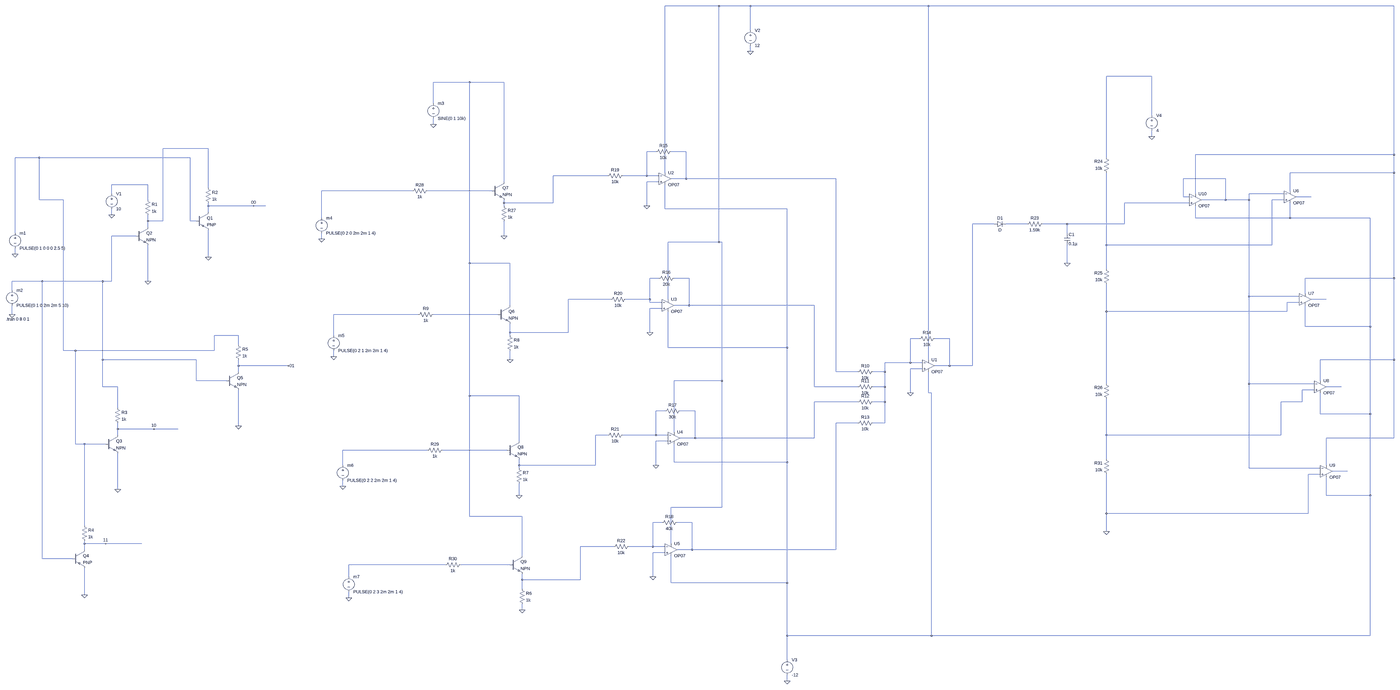
[diagram p0: schematic 4ary ask_final_2.asc, whole sheet]
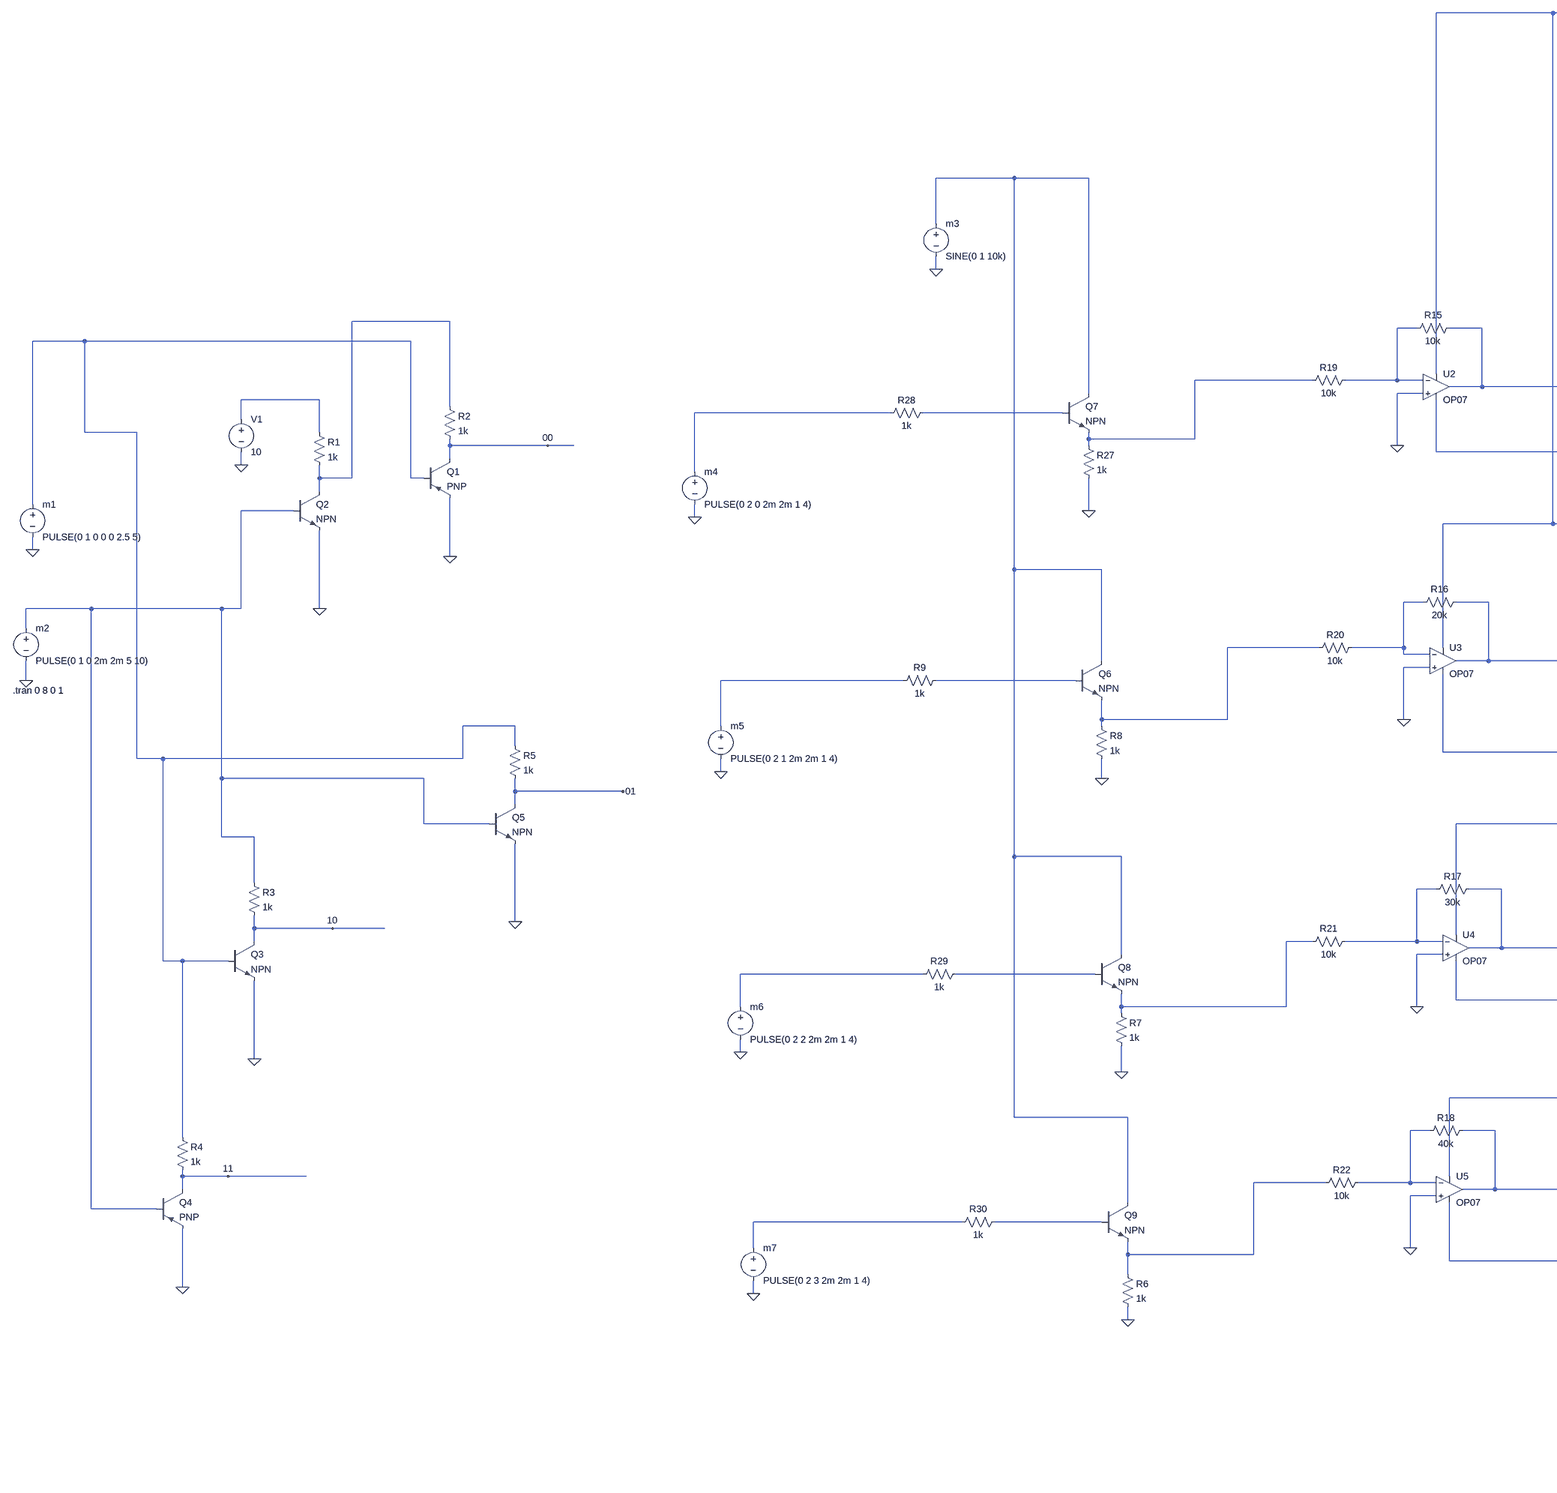
[diagram p1: schematic 4ary ask_final_2.asc, part, row 1 of 1, column 1 of 2]
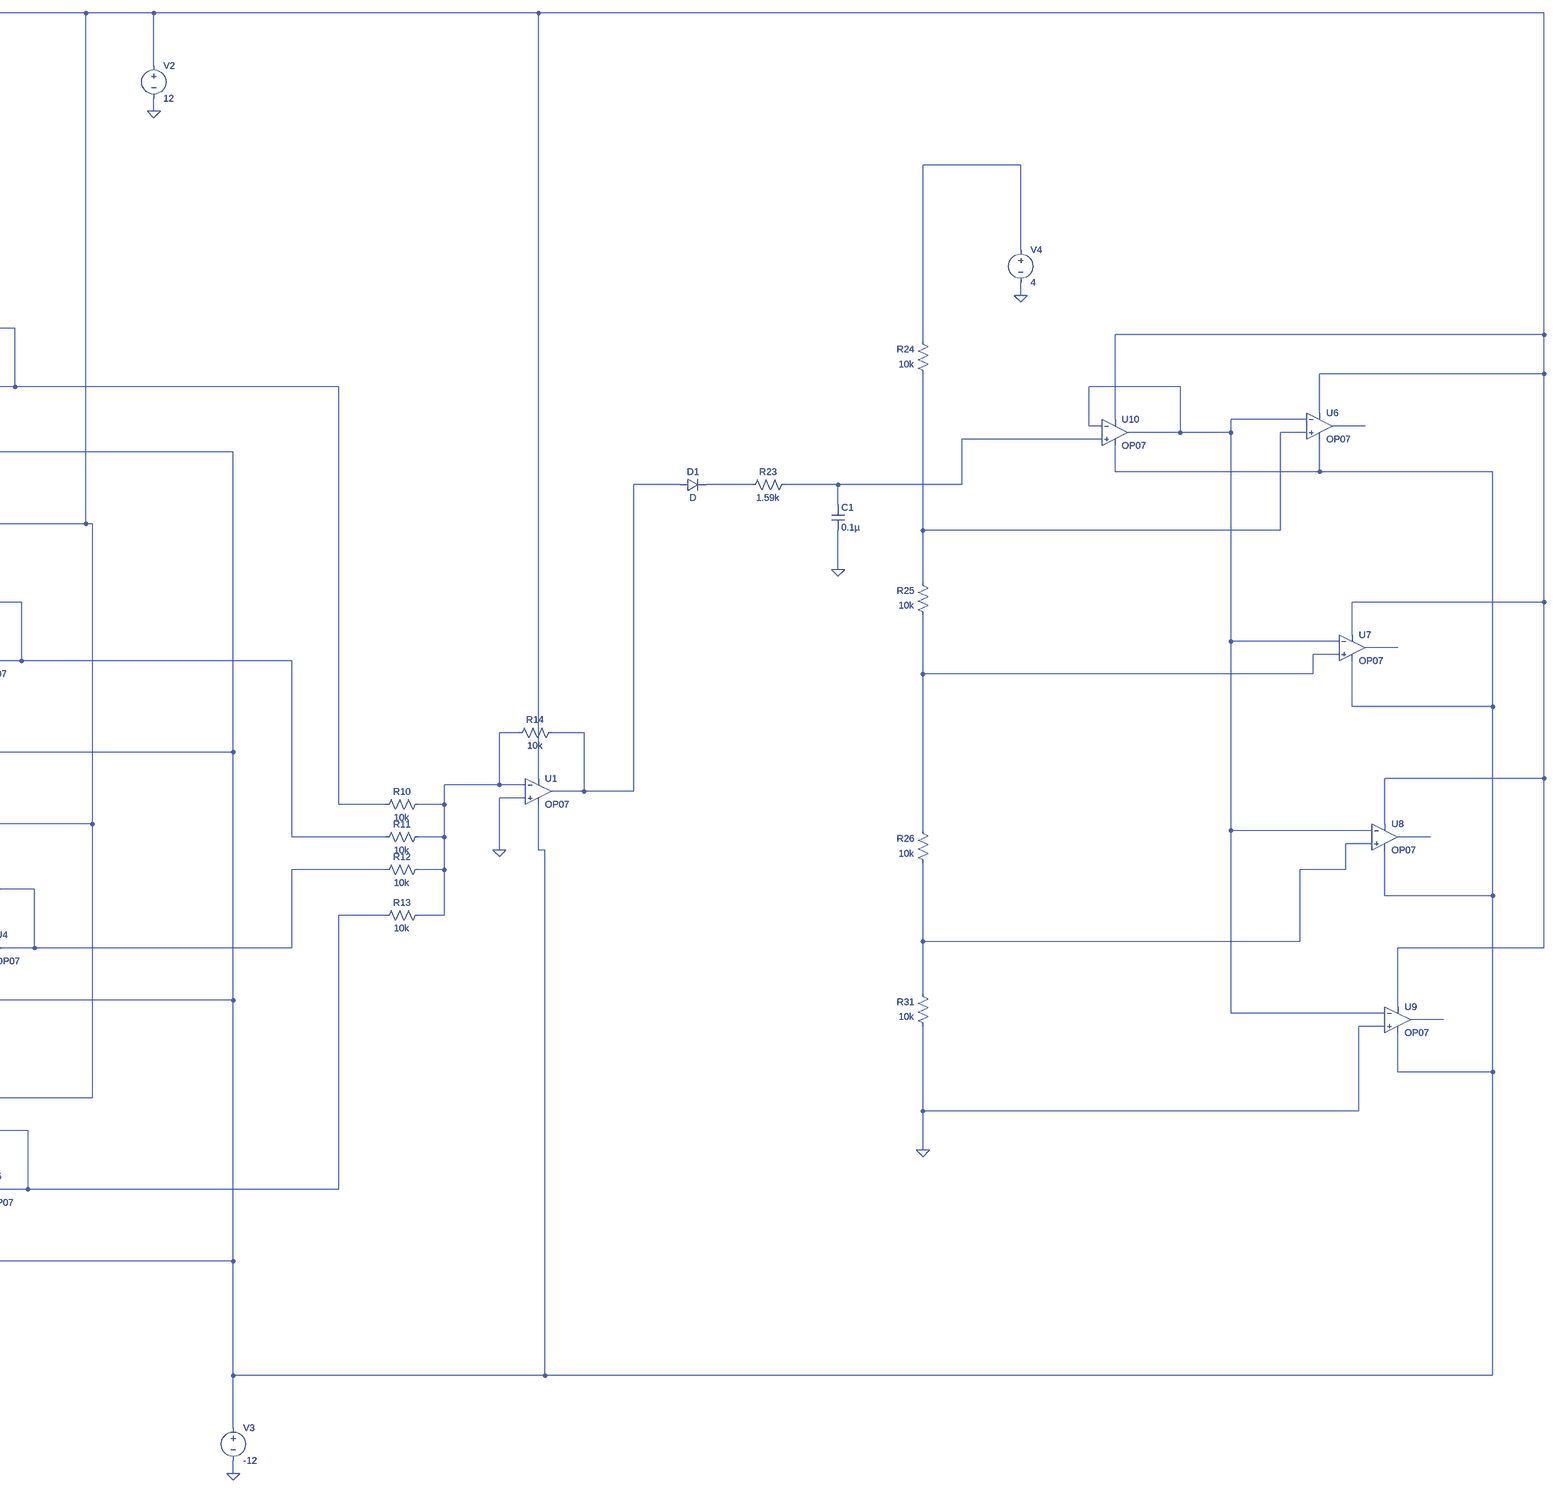
[diagram p2: schematic 4ary ask_final_2.asc, part, row 1 of 1, column 2 of 2]
4ary ask_final_2.asc, the LTspice schematic file:
Version 4
SHEET 1 11336 2708
WIRE 3808 -1664 3248 -1664
WIRE 4320 -1664 3808 -1664
WIRE 5904 -1664 4320 -1664
WIRE 11328 -1664 5904 -1664
WIRE 4320 -1456 4320 -1664
WIRE 4320 -1344 4320 -1376
WIRE 8880 -848 8640 -848
WIRE 2080 -816 1888 -816
WIRE 2384 -816 2080 -816
WIRE 1888 -704 1888 -816
WIRE 8880 -640 8880 -848
WIRE 1888 -592 1888 -624
WIRE 8880 -528 8880 -560
WIRE 256 -464 16 -464
WIRE 3200 -448 3152 -448
WIRE 3360 -448 3280 -448
WIRE 11328 -432 11328 -1664
WIRE 11328 -432 9200 -432
WIRE -640 -416 -768 -416
WIRE 160 -416 -640 -416
WIRE 8640 -416 8640 -848
WIRE 3248 -336 3248 -1664
WIRE 11328 -336 11328 -432
WIRE 11328 -336 10224 -336
WIRE 2944 -320 2656 -320
WIRE 3152 -320 3152 -448
WIRE 3152 -320 3024 -320
WIRE 3216 -320 3152 -320
WIRE 3360 -304 3360 -448
WIRE 3360 -304 3280 -304
WIRE 5008 -304 3360 -304
WIRE 9360 -304 9136 -304
WIRE 2384 -288 2384 -816
WIRE 3216 -288 3152 -288
WIRE -64 -272 -256 -272
WIRE 256 -256 256 -464
WIRE 1776 -240 1296 -240
WIRE 2320 -240 1856 -240
WIRE 10224 -240 10224 -336
WIRE -256 -224 -256 -272
WIRE 9200 -224 9200 -432
WIRE 10192 -224 9600 -224
WIRE 9136 -208 9136 -304
WIRE 9168 -208 9136 -208
WIRE 10336 -208 10256 -208
WIRE -640 -192 -640 -416
WIRE -512 -192 -640 -192
WIRE -64 -192 -64 -272
WIRE 9360 -192 9360 -304
WIRE 9360 -192 9232 -192
WIRE 9600 -192 9600 -224
WIRE 9600 -192 9360 -192
WIRE 10192 -192 10128 -192
WIRE 2384 -176 2384 -192
WIRE 2656 -176 2656 -320
WIRE 2656 -176 2384 -176
WIRE 9168 -176 8736 -176
WIRE 256 -160 256 -176
WIRE 496 -160 256 -160
WIRE 560 -160 496 -160
WIRE 2384 -160 2384 -176
WIRE 3152 -160 3152 -288
WIRE 3248 -144 3248 -272
WIRE 4688 -144 3248 -144
WIRE 256 -128 256 -160
WIRE -256 -112 -256 -144
WIRE 1296 -96 1296 -240
WIRE 9200 -96 9200 -160
WIRE 10224 -96 10224 -176
WIRE 10224 -96 9200 -96
WIRE 10864 -96 10224 -96
WIRE -64 -80 -64 -112
WIRE 16 -80 16 -464
WIRE 16 -80 -64 -80
WIRE 160 -80 160 -416
WIRE 192 -80 160 -80
WIRE 8000 -64 6448 -64
WIRE 8208 -64 8064 -64
WIRE 8432 -64 8288 -64
WIRE 8736 -64 8736 -176
WIRE 8736 -64 8432 -64
WIRE -64 -48 -64 -80
WIRE -768 -16 -768 -416
WIRE 8432 -16 8432 -64
WIRE -128 0 -256 0
WIRE 2384 0 2384 -80
WIRE 1296 16 1296 -16
WIRE 3808 32 3808 -1664
WIRE 3808 32 3264 32
WIRE 3824 32 3808 32
WIRE 8640 48 8640 -336
WIRE 10128 48 10128 -192
WIRE 10128 48 8640 48
WIRE -768 96 -768 64
WIRE 256 112 256 -32
WIRE 2080 144 2080 -816
WIRE 2416 144 2080 144
WIRE 8432 144 8432 48
WIRE 8640 176 8640 48
WIRE 3216 224 3168 224
WIRE 3376 224 3296 224
WIRE 11328 224 11328 -336
WIRE 11328 224 10304 224
WIRE -624 240 -784 240
WIRE -304 240 -624 240
WIRE -256 240 -256 0
WIRE -256 240 -304 240
WIRE -64 240 -64 48
WIRE -784 288 -784 240
WIRE 10304 304 10304 224
WIRE 9600 320 9600 -192
WIRE 10272 320 9600 320
WIRE 2960 336 2736 336
WIRE 3168 336 3168 224
WIRE 3168 336 3040 336
WIRE 3264 336 3264 32
WIRE 10416 336 10336 336
WIRE 3168 352 3168 336
WIRE 3232 352 3168 352
WIRE 10272 352 10208 352
WIRE 2416 368 2416 144
WIRE 3376 368 3376 224
WIRE 3376 368 3296 368
WIRE 4832 368 3376 368
WIRE 3232 384 3168 384
WIRE 8640 400 8640 256
WIRE 10208 400 10208 352
WIRE 10208 400 8640 400
WIRE -784 416 -784 368
WIRE 1808 416 1360 416
WIRE 2352 416 1888 416
WIRE 10304 480 10304 368
WIRE 10864 480 10864 -96
WIRE 10864 480 10304 480
WIRE 2416 512 2416 464
WIRE 2736 512 2736 336
WIRE 2736 512 2416 512
WIRE 3168 512 3168 384
WIRE 416 528 288 528
WIRE 1360 528 1360 416
WIRE 2416 528 2416 512
WIRE 5856 544 5808 544
WIRE 6016 544 5936 544
WIRE 416 576 416 528
WIRE 3264 592 3264 400
WIRE 4688 592 4688 -144
WIRE 4688 592 3264 592
WIRE -512 608 -512 -192
WIRE -448 608 -512 608
WIRE 288 608 288 528
WIRE 288 608 -448 608
WIRE 1360 640 1360 608
WIRE -304 656 -304 240
WIRE 192 656 -304 656
WIRE 2416 656 2416 608
WIRE 5904 656 5904 -1664
WIRE 11328 656 11328 224
WIRE 11328 656 10384 656
WIRE 5808 672 5808 544
WIRE 5808 672 5616 672
WIRE 5872 672 5808 672
WIRE 416 688 416 656
WIRE 752 688 416 688
WIRE 6016 688 6016 544
WIRE 6016 688 5936 688
WIRE 6448 688 6448 -64
WIRE 6448 688 6016 688
WIRE 5872 704 5808 704
WIRE 416 720 416 688
WIRE 5008 720 5008 -304
WIRE 5472 720 5008 720
WIRE 5616 720 5616 672
WIRE 5616 720 5552 720
WIRE 192 768 192 656
WIRE 352 768 192 768
WIRE 3824 768 3824 32
WIRE 3824 768 3296 768
WIRE 10384 768 10384 656
WIRE 8640 784 8640 400
WIRE 9600 784 9600 320
WIRE 10352 784 9600 784
WIRE -304 800 -304 656
WIRE -224 800 -304 800
WIRE 4832 800 4832 368
WIRE 5472 800 4832 800
WIRE 5616 800 5616 720
WIRE 5616 800 5552 800
WIRE 10496 800 10416 800
WIRE 10352 816 10288 816
WIRE 5808 832 5808 704
WIRE 5904 832 5904 720
WIRE 5920 832 5904 832
WIRE 2080 848 2080 144
WIRE 2464 848 2080 848
WIRE 5472 880 4832 880
WIRE 5616 880 5616 800
WIRE 5616 880 5552 880
WIRE 10288 880 10288 816
WIRE 10288 880 10176 880
WIRE -224 912 -224 800
WIRE 3248 928 3200 928
WIRE 3408 928 3328 928
WIRE 10384 944 10384 832
WIRE 10864 944 10864 480
WIRE 10864 944 10384 944
WIRE 5472 992 5008 992
WIRE 5616 992 5616 880
WIRE 5616 992 5552 992
WIRE 416 1008 416 816
WIRE -224 1024 -224 992
WIRE -32 1024 -224 1024
WIRE 96 1024 -32 1024
WIRE 3296 1040 3296 768
WIRE -224 1056 -224 1024
WIRE 2944 1056 2880 1056
WIRE 3200 1056 3200 928
WIRE 3200 1056 3024 1056
WIRE 3264 1056 3200 1056
WIRE 8640 1056 8640 864
WIRE 10176 1056 10176 880
WIRE 10176 1056 8640 1056
WIRE 3408 1072 3408 928
WIRE 3408 1072 3328 1072
WIRE 4832 1072 4832 880
WIRE 4832 1072 3408 1072
WIRE 11328 1072 11328 656
WIRE 11328 1072 10416 1072
WIRE 2464 1088 2464 848
WIRE 3264 1088 3200 1088
WIRE -448 1104 -448 608
WIRE -400 1104 -448 1104
WIRE -288 1104 -400 1104
WIRE 1856 1136 1408 1136
WIRE 2400 1136 1936 1136
WIRE 8640 1184 8640 1056
WIRE 3296 1200 3296 1104
WIRE 4688 1200 4688 592
WIRE 4688 1200 3296 1200
WIRE 1408 1216 1408 1136
WIRE 2464 1216 2464 1184
WIRE 2880 1216 2880 1056
WIRE 2880 1216 2464 1216
WIRE 3200 1216 3200 1088
WIRE 10416 1216 10416 1072
WIRE 2464 1232 2464 1216
WIRE 9600 1232 9600 784
WIRE 10384 1232 9600 1232
WIRE 10528 1248 10448 1248
WIRE 10384 1264 10320 1264
WIRE 1408 1328 1408 1296
WIRE -224 1344 -224 1152
WIRE 2464 1376 2464 1312
WIRE 10416 1376 10416 1280
WIRE 10864 1376 10864 944
WIRE 10864 1376 10416 1376
WIRE 3824 1440 3824 768
WIRE 3824 1440 3280 1440
WIRE 8640 1472 8640 1264
WIRE 10320 1472 10320 1264
WIRE 10320 1472 8640 1472
WIRE 2080 1488 2080 848
WIRE 2480 1488 2080 1488
WIRE 3232 1520 3184 1520
WIRE 3392 1520 3312 1520
WIRE -400 1536 -400 1104
WIRE 8640 1568 8640 1472
WIRE -400 1632 -400 1616
WIRE -288 1632 -400 1632
WIRE -96 1632 -288 1632
WIRE 3280 1632 3280 1440
WIRE 2976 1648 2800 1648
WIRE 3184 1648 3184 1520
WIRE 3184 1648 3056 1648
WIRE 3248 1648 3184 1648
WIRE -400 1664 -400 1632
WIRE 3392 1664 3392 1520
WIRE 3392 1664 3312 1664
WIRE 5008 1664 5008 992
WIRE 5008 1664 3392 1664
WIRE 3248 1680 3184 1680
WIRE 2480 1696 2480 1488
WIRE -624 1712 -624 240
WIRE -464 1712 -624 1712
WIRE 1952 1744 1440 1744
WIRE 2416 1744 2032 1744
WIRE 1440 1808 1440 1744
WIRE 3184 1808 3184 1680
WIRE 2480 1824 2480 1792
WIRE 2800 1824 2800 1648
WIRE 2800 1824 2480 1824
WIRE 3280 1840 3280 1696
WIRE 4688 1840 4688 1200
WIRE 4688 1840 3280 1840
WIRE 2480 1872 2480 1824
WIRE -400 1904 -400 1760
WIRE 1440 1920 1440 1888
WIRE 2480 1984 2480 1952
WIRE 4688 2400 4688 1840
WIRE 5920 2400 5920 832
WIRE 5920 2400 4688 2400
WIRE 10864 2400 10864 1376
WIRE 10864 2400 5920 2400
WIRE 4688 2576 4688 2400
WIRE 4688 2688 4688 2656
FLAG 256 112 0
FLAG -256 -112 0
FLAG -768 96 0
FLAG -784 416 0
FLAG -64 240 0
FLAG 416 1008 0
FLAG -224 1344 0
FLAG -400 1904 0
FLAG 496 -160 00
FLAG 752 688 01
FLAG -32 1024 10
FLAG -288 1632 11
FLAG 2416 656 0
FLAG 2384 0 0
FLAG 2464 1376 0
FLAG 2480 1984 0
FLAG 1888 -592 0
FLAG 5808 832 0
FLAG 3152 -160 0
FLAG 3168 512 0
FLAG 3200 1216 0
FLAG 3184 1808 0
FLAG 8640 1568 0
FLAG 1296 16 0
FLAG 1360 640 0
FLAG 1408 1328 0
FLAG 1440 1920 0
FLAG 4320 -1344 0
FLAG 4688 2688 0
FLAG 8432 144 0
FLAG 8880 -528 0
SYMBOL voltage -768 -32 R0
WINDOW 123 0 0 Left 0
WINDOW 39 0 0 Left 0
SYMATTR InstName m1
SYMATTR Value PULSE(0 1 0 0 0 2.5 5)
SYMBOL voltage -784 272 R0
WINDOW 123 0 0 Left 0
WINDOW 39 0 0 Left 0
SYMATTR InstName m2
SYMATTR Value PULSE(0 1 0 2m 2m 5 10)
SYMBOL res -80 -208 R0
SYMATTR InstName R1
SYMATTR Value 1k
SYMBOL voltage -256 -240 R0
WINDOW 123 0 0 Left 0
WINDOW 39 0 0 Left 0
SYMATTR InstName V1
SYMATTR Value 10
SYMBOL res 240 -272 R0
SYMATTR InstName R2
SYMATTR Value 1k
SYMBOL pnp 192 -128 R0
SYMATTR InstName Q1
SYMBOL npn -128 -48 R0
SYMATTR InstName Q2
SYMBOL res 400 560 R0
SYMATTR InstName R5
SYMATTR Value 1k
SYMBOL npn 352 720 R0
SYMATTR InstName Q5
SYMBOL res -240 896 R0
SYMATTR InstName R3
SYMATTR Value 1k
SYMBOL npn -288 1056 R0
SYMATTR InstName Q3
SYMBOL res -416 1520 R0
SYMATTR InstName R4
SYMATTR Value 1k
SYMBOL pnp -464 1664 R0
SYMATTR InstName Q4
SYMBOL npn 2352 368 R0
SYMATTR InstName Q6
SYMBOL npn 2320 -288 R0
SYMATTR InstName Q7
SYMBOL npn 2400 1088 R0
SYMATTR InstName Q8
SYMBOL npn 2416 1696 R0
SYMATTR InstName Q9
SYMBOL voltage 1888 -720 R0
WINDOW 123 0 0 Left 0
WINDOW 39 0 0 Left 0
SYMATTR InstName m3
SYMATTR Value SINE(0 1 10k)
SYMBOL OpAmps\\OP07 5904 624 R0
SYMATTR InstName U1
SYMBOL res 5568 704 R90
WINDOW 0 0 56 VBottom 2
WINDOW 3 32 56 VTop 2
SYMATTR InstName R10
SYMATTR Value 10k
SYMBOL res 5568 784 R90
WINDOW 0 0 56 VBottom 2
WINDOW 3 32 56 VTop 2
SYMATTR InstName R11
SYMATTR Value 10k
SYMBOL res 5568 864 R90
WINDOW 0 0 56 VBottom 2
WINDOW 3 32 56 VTop 2
SYMATTR InstName R12
SYMATTR Value 10k
SYMBOL res 5568 976 R90
WINDOW 0 0 56 VBottom 2
WINDOW 3 32 56 VTop 2
SYMATTR InstName R13
SYMATTR Value 10k
SYMBOL res 5952 528 R90
WINDOW 0 0 56 VBottom 2
WINDOW 3 32 56 VTop 2
SYMATTR InstName R14
SYMATTR Value 10k
SYMBOL OpAmps\\OP07 3248 -368 R0
SYMATTR InstName U2
SYMBOL res 3296 -464 R90
WINDOW 0 0 56 VBottom 2
WINDOW 3 32 56 VTop 2
SYMATTR InstName R15
SYMATTR Value 10k
SYMBOL OpAmps\\OP07 3264 304 R0
SYMATTR InstName U3
SYMBOL res 3312 208 R90
WINDOW 0 0 56 VBottom 2
WINDOW 3 32 56 VTop 2
SYMATTR InstName R16
SYMATTR Value 20k
SYMBOL OpAmps\\OP07 3296 1008 R0
SYMATTR InstName U4
SYMBOL res 3344 912 R90
WINDOW 0 0 56 VBottom 2
WINDOW 3 32 56 VTop 2
SYMATTR InstName R17
SYMATTR Value 30k
SYMBOL OpAmps\\OP07 3280 1600 R0
SYMATTR InstName U5
SYMBOL res 3328 1504 R90
WINDOW 0 0 56 VBottom 2
WINDOW 3 32 56 VTop 2
SYMATTR InstName R18
SYMATTR Value 40k
SYMBOL res 3040 -336 R90
WINDOW 0 0 56 VBottom 2
WINDOW 3 32 56 VTop 2
SYMATTR InstName R19
SYMATTR Value 10k
SYMBOL res 3056 320 R90
WINDOW 0 0 56 VBottom 2
WINDOW 3 32 56 VTop 2
SYMATTR InstName R20
SYMATTR Value 10k
SYMBOL res 3040 1040 R90
WINDOW 0 0 56 VBottom 2
WINDOW 3 32 56 VTop 2
SYMATTR InstName R21
SYMATTR Value 10k
SYMBOL res 3072 1632 R90
WINDOW 0 0 56 VBottom 2
WINDOW 3 32 56 VTop 2
SYMATTR InstName R22
SYMATTR Value 10k
SYMBOL diode 8000 -48 R270
WINDOW 0 32 32 VTop 2
WINDOW 3 0 32 VBottom 2
SYMATTR InstName D1
SYMBOL res 8304 -80 R90
WINDOW 0 0 56 VBottom 2
WINDOW 3 32 56 VTop 2
SYMATTR InstName R23
SYMATTR Value 1.59k
SYMBOL cap 8416 -16 R0
SYMATTR InstName C1
SYMATTR Value 0.1µ
SYMBOL OpAmps\\OP07 10224 -272 R0
SYMATTR InstName U6
SYMBOL OpAmps\\OP07 10304 272 R0
SYMATTR InstName U7
SYMBOL OpAmps\\OP07 10384 736 R0
SYMATTR InstName U8
SYMBOL OpAmps\\OP07 10416 1184 R0
SYMATTR InstName U9
SYMBOL voltage 1296 -112 R0
WINDOW 123 0 0 Left 0
WINDOW 39 0 0 Left 0
SYMATTR InstName m4
SYMATTR Value PULSE(0 2 0 2m 2m 1 4)
SYMBOL voltage 1360 512 R0
WINDOW 123 0 0 Left 0
WINDOW 39 0 0 Left 0
SYMATTR InstName m5
SYMATTR Value PULSE(0 2 1 2m 2m 1 4)
SYMBOL voltage 1408 1200 R0
WINDOW 123 0 0 Left 0
WINDOW 39 0 0 Left 0
SYMATTR InstName m6
SYMATTR Value PULSE(0 2 2 2m 2m 1 4)
SYMBOL voltage 1440 1792 R0
WINDOW 123 0 0 Left 0
WINDOW 39 0 0 Left 0
SYMATTR InstName m7
SYMATTR Value PULSE(0 2 3 2m 2m 1 4)
SYMBOL voltage 4320 -1472 R0
WINDOW 123 0 0 Left 0
WINDOW 39 0 0 Left 0
SYMATTR InstName V2
SYMATTR Value 12
SYMBOL voltage 4688 2560 R0
WINDOW 123 0 0 Left 0
WINDOW 39 0 0 Left 0
SYMATTR InstName V3
SYMATTR Value -12
SYMBOL res 2464 1856 R0
SYMATTR InstName R6
SYMATTR Value 1k
SYMBOL res 2448 1216 R0
SYMATTR InstName R7
SYMATTR Value 1k
SYMBOL res 2400 512 R0
SYMATTR InstName R8
SYMATTR Value 1k
SYMBOL res 2368 -176 R0
SYMATTR InstName R27
SYMATTR Value 1k
SYMBOL res 1904 400 R90
WINDOW 0 0 56 VBottom 2
WINDOW 3 32 56 VTop 2
SYMATTR InstName R9
SYMATTR Value 1k
SYMBOL res 1872 -256 R90
WINDOW 0 0 56 VBottom 2
WINDOW 3 32 56 VTop 2
SYMATTR InstName R28
SYMATTR Value 1k
SYMBOL res 1952 1120 R90
WINDOW 0 0 56 VBottom 2
WINDOW 3 32 56 VTop 2
SYMATTR InstName R29
SYMATTR Value 1k
SYMBOL res 2048 1728 R90
WINDOW 0 0 56 VBottom 2
WINDOW 3 32 56 VTop 2
SYMATTR InstName R30
SYMATTR Value 1k
SYMBOL voltage 8880 -656 R0
WINDOW 123 0 0 Left 0
WINDOW 39 0 0 Left 0
SYMATTR InstName V4
SYMATTR Value 4
SYMBOL res 8656 -320 R180
WINDOW 0 36 76 Left 2
WINDOW 3 36 40 Left 2
SYMATTR InstName R24
SYMATTR Value 10k
SYMBOL res 8656 272 R180
WINDOW 0 36 76 Left 2
WINDOW 3 36 40 Left 2
SYMATTR InstName R25
SYMATTR Value 10k
SYMBOL res 8656 880 R180
WINDOW 0 36 76 Left 2
WINDOW 3 36 40 Left 2
SYMATTR InstName R26
SYMATTR Value 10k
SYMBOL OpAmps\\OP07 9200 -256 R0
SYMATTR InstName U10
SYMBOL res 8656 1280 R180
WINDOW 0 36 76 Left 2
WINDOW 3 36 40 Left 2
SYMATTR InstName R31
SYMATTR Value 10k
TEXT -816 440 Left 2 !.tran 0 8 0 1

The netlist it stands for:
* 4ary ask_final_2.asc
V§m1 N007 0 PULSE(0 1 0 0 0 2.5 5)
V§m2 N019 0 PULSE(0 1 0 2m 2m 5 10)
R1 N010 N004 1k
V1 N010 0 10
R2 N004 00 1k
Q1 00 N007 0 0 PNP
Q2 N004 N019 0 0 NPN
R5 N007 01 1k
Q5 01 N019 0 0 NPN
R3 N019 10 1k
Q3 10 N007 0 0 NPN
R4 N007 11 1k
Q4 11 N019 0 0 PNP
Q6 N003 N026 N022 0 NPN
Q7 N003 N012 N008 0 NPN
Q8 N003 N035 N033 0 NPN
Q9 N003 N040 N038 0 NPN
V§m3 N003 0 SINE(0 1 10k)
XU1 0 N027 N001 N016 N017 LT1001  ; OP07, pins In+ In- V+ V- OUT
R10 N027 N006 10k
R11 N027 N021 10k
R12 N027 N030 10k
R13 N027 N032 10k
R14 N017 N027 10k
XU2 0 N005 N001 N016 N006 LT1001  ; OP07, pins In+ In- V+ V- OUT
R15 N006 N005 10k
XU3 0 N020 N001 N016 N021 LT1001  ; OP07, pins In+ In- V+ V- OUT
R16 N021 N020 20k
XU4 0 N031 N001 N016 N030 LT1001  ; OP07, pins In+ In- V+ V- OUT
R17 N030 N031 30k
XU5 0 N037 N001 N016 N032 LT1001  ; OP07, pins In+ In- V+ V- OUT
R18 N032 N037 40k
R19 N005 N008 10k
R20 N020 N022 10k
R21 N031 N033 10k
R22 N037 N038 10k
D1 N017 N018 D
R23 N015 N018 1.59k
C1 N015 0 0.1µ
XU6 N014 N009 N001 N016 N013 LT1001  ; OP07, pins In+ In- V+ V- OUT
XU7 N024 N009 N001 N016 N023 LT1001  ; OP07, pins In+ In- V+ V- OUT
XU8 N029 N009 N001 N016 N028 LT1001  ; OP07, pins In+ In- V+ V- OUT
XU9 0 N009 N001 N016 N036 LT1001  ; OP07, pins In+ In- V+ V- OUT
V§m4 N011 0 PULSE(0 2 0 2m 2m 1 4)
V§m5 N025 0 PULSE(0 2 1 2m 2m 1 4)
V§m6 N034 0 PULSE(0 2 2 2m 2m 1 4)
V§m7 N039 0 PULSE(0 2 3 2m 2m 1 4)
V2 N001 0 12
V3 N016 0 -12
R6 N038 0 1k
R7 N033 0 1k
R8 N022 0 1k
R27 N008 0 1k
R9 N026 N025 1k
R28 N012 N011 1k
R29 N035 N034 1k
R30 N040 N039 1k
V4 N002 0 4
R24 N014 N002 10k
R25 N024 N014 10k
R26 N029 N024 10k
XU10 N015 N009 N001 N016 N009 LT1001  ; OP07, pins In+ In- V+ V- OUT
R31 0 N029 10k
.model D D
.lib standard.dio
.model NPN NPN
.model PNP PNP
.lib standard.bjt
.tran 0 8 0 1
.lib LTC.lib
.backanno
.end